# Altium schematic sheet RF.SchDoc
size A4; SheetNumber: 4; SheetTotal: 5
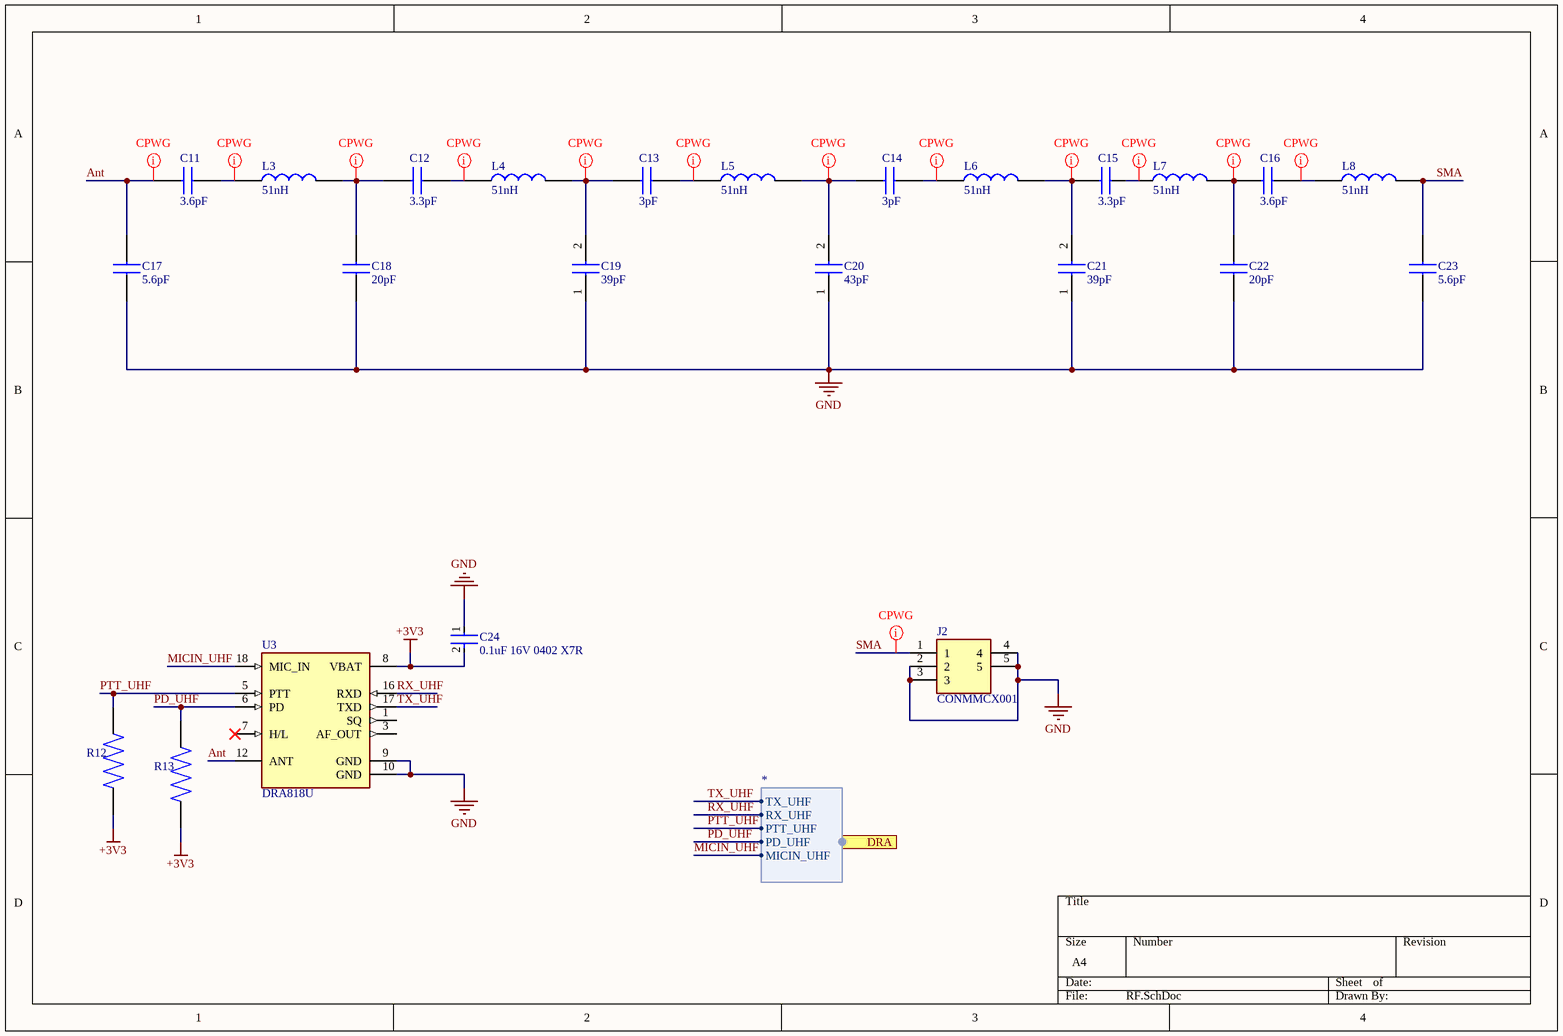
[diagram p0: RF.SchDoc]

## Parts
C11  3.6pF  [CAP0603S]
C12  3.3pF  [CAP0603S]
C13  3pF  [CAP0402S]
C14  3pF  [CAP0402S]
C15  3.3pF  [CAP0603S]
C16  3.6pF  [CAP0603S]
C17  5.6pF  [CAP0603S]
C18  20pF  [CAP0603S]
C19  39pF  [CAP0603S]
C20  43pF  [CAP0603S]
C21  39pF  [CAP0603S]
C22  20pF  [CAP0603S]
C23  5.6pF  [CAP0603S]
C24  0.1uF 16V 0402 X7R  [CAP0402S]
J2  CONMMCX001  [SAMTEC_MMCX-J-P-H-ST-SM1]
L3  51nH  [IND0603S]
L4  51nH  [IND0603S]
L5  51nH  [IND0603S]
L6  51nH  [IND0603S]
L7  51nH  [IND0603S]
L8  51nH  [IND0603S]
R12  CRCW060310K0FKEAC  [RES0603S]  (value not drawn)
R13  CRCW060310K0FKEAC  [RES0603S]  (value not drawn)
U3  DRA818U  [DRA818U]

## Ports
DRA (harness *)

## Harnesses
*: TX_UHF, RX_UHF, PTT_UHF, PD_UHF, MICIN_UHF

## Nets
+3V3: C24.2 R12.1 R13.1 U3.8(VBAT)
GND: C17.1 C18.1 C19.1 C20.1 C21.1 C22.1 C23.1 C24.1 J2.2 J2.3 J2.4 J2.5 U3.9(GND) U3.10(GND)
Ant: C11.1 C17.2 U3.12(ANT)
MICIN_UHF: U3.18(MIC_IN) ; port DRA.MICIN_UHF
PD_UHF: R13.2 U3.6(PD) ; port DRA.PD_UHF
PTT_UHF: R12.2 U3.5(PTT) ; port DRA.PTT_UHF
RX_UHF: U3.16(RXD) ; port DRA.RX_UHF
SMA: C23.2 J2.1 L8.2
TX_UHF: U3.17(TXD) ; port DRA.TX_UHF
NetC11_2: C11.2 L3.1
NetC12_1: C12.1 C18.2 L3.2
NetC12_2: C12.2 L4.1
NetC13_1: C13.1 C19.2 L4.2
NetC13_2: C13.2 L5.1
NetC14_1: C14.1 C20.2 L5.2
NetC14_2: C14.2 L6.1
NetC15_1: C15.1 C21.2 L6.2
NetC15_2: C15.2 L7.1
NetC16_1: C16.1 C22.2 L7.2
NetC16_2: C16.2 L8.1

Not connected (* = marked no-connect by the designer): U3 1(SQ) 3(AF_OUT) 7(H/L)*

## Layout directives
net class CPWG: Ant, NetC11_2, NetC12_1, NetC12_2, NetC13_1, NetC13_2, NetC14_1, NetC14_2, NetC15_1, NetC15_2, NetC16_1, NetC16_2, SMA

## Library data of the parts
C11 C16 = CBR06C369BAGAC: CBR-SMD RF C0G, Ceramic, 3.6 pF, +/-0.1 pF, 250 VDC, 500 VDC, 125C, -55C, C0G, SMD, Fixed, RF, Ultra High Q, Low ESR, Class I, 0.21 % , 10 GOhms, 472, 5.6 mg, 0603, 1.6mm, 0.8mm, 0.8mm, 0.4mm, 4000, 78  Weeks, 120; Manufacturer_Name: KEMET; Geometry.Height: 0.87mm; element14 Part Number: *; element14 Price/Stock: *; Manufacturer_Part_Number: CBR06C369BAGAC; Datasheet Link: http://www.kemet.com/Lists/ProductCatalog/Attachments/490/KEM_C1030_CBR_SMD.pdf
C12 C15 = VJ0603D3R3BXPAJ: Vishay 0603 VJ 3.3pF Ceramic Multilayer Capacitor, 250 V, +125C, COG Dielectric, +/-0.1pF SMD; Geometry.Height: 0.94mm; element14 Part Number: *; element14 Price/Stock: *; Manufacturer_Name: Vishay; Manufacturer_Part_Number: VJ0603D3R3BXPAJ; Datasheet Link: https://g.componentsearchengine.com/Datasheets/2/VJ0603D3R3BXPAJ.pdf
C13 C14 = VJ0603D3R3BXPAJ: QSCF500Q3R0B1GV001T JOHANSON TECHNOLOGY, Capacitor, RF, 3 pF, 50 V, S Series, ± 0.1pF, 150 °C, 0402 [1005 Metric]; Manufacturer_Name: Vishay; Geometry.Height: 0.94mm; element14 Part Number: *; element14 Price/Stock: *; Manufacturer_Part_Number: VJ0603D3R3BXPAJ; Datasheet Link: https://g.componentsearchengine.com/Datasheets/2/VJ0603D3R3BXPAJ.pdf
C17 C23 = 06032U5R6CAT2A: AVX 0603 U 5.6pF Ceramic Multilayer Capacitor, 200 V dc, +125C, C0G Dielectric, +/-0.25pF SMD; Manufacturer_Name: Kyocera AVX; Geometry.Height: 0.9mm; Mouser Part Number: 581-06032U5R6CAT2A; Mouser Price/Stock: https://www.mouser.com/Search/Refine.aspx?Keyword=581-06032U5R6CAT2A; Manufacturer_Part_Number: 06032U5R6CAT2A; Datasheet Link: https://componentsearchengine.com/Datasheets/1/06032U5R6CAT2A.pdf
C18 C22 = CBR02C200F5GAC: CBR-SMD RF C0G, Ceramic, 20 pF, 1%, 50 VDC, 125 VDC, 125C, -55C, C0G, SMD, Fixed, RF, Ultra High Q, Low ESR, Class I, 0.12 % , 10 GOhms, 800, 0.3 mg, 0201, 0.6mm, 0.3mm, 0.3mm, 0.15mm, 15000, 78  Weeks, 120; Manufacturer_Name: KEMET; Geometry.Height: 0.33mm; element14 Part Number: *; element14 Price/Stock: *; Manufacturer_Part_Number: CBR02C200F5GAC; Datasheet Link: http://www.kemet.com/Lists/ProductCatalog/Attachments/490/KEM_C1030_CBR_SMD.pdf
C19 = C0603H390J5GACTU: Capacitor-C0603H390J5GACTU; Manufacturer_Name: KEMET; Datasheet Link: https://content.kemet.com/datasheets/KEM_C1001_C0G_200C_SMD.pdf; Height: 0.87mm; Manufacturer_Part_Number: C0603H390J5GACTU
C20 = CBR06C430J5GACAUTO: Capacitor; Manufacturer_Name: KEMET; Datasheet Link: https://search.kemet.com/download/datasheet/CBR06C430J5GACAUTO; Manufacturer_Part_Number: CBR06C430J5GACAUTO; Mouser Part Number: 80-CBR06C430J5GAUTO; Mouser Price/Stock: https://www.mouser.co.uk/ProductDetail/KEMET/CBR06C430J5GACAUTO?qs=By6Nw2ByBD0kalJAqVwXIA%3D%3D
C21 = C0603H390J5GACTU: Capacitor; Manufacturer_Name: KEMET; Datasheet Link: https://content.kemet.com/datasheets/KEM_C1001_C0G_200C_SMD.pdf; Height: 0.87mm; Manufacturer_Part_Number: C0603H390J5GACTU
C24 = 236180d848d6139a670b325ea6854c9: CAP CER 0.1UF 16V X7R 0402; Manufacturer Part Number: GRM155R71C104KA88D; Manufacturer: Murata; Standoff Height: 0mm; Tolerance: 10%; Voltage Rating: 16Vdc; Material: Ceramic; Capacitance: 0.10μF; Value: 0.10μF; RoHS: TRUE; Temperature Characteristic: X7R; Octopart: https://octopart.com/grm155r71c104ka88d-murata-196880; Digikey Description: CAP CER 0.1UF 16V X7R 0402; Device Class L3: Ceramic Capacitors; Height: 0.55mm; ComponentLink2Description: Datasheet; Temperature Range Low: -55°C; Ipc Land Pattern Name: CAPC10050X219; ComponentLink2URL: https://search.murata.co.jp/Ceramy/image/img/A01X/G101/ENG/GRM155R71H471KA01-01A.pdf; Device Class L1: Passive Components; Lead Free: yes; Category: Cap; Package: GRM15; Temperature: -55°C to +125°C; Device Class L2: Capacitors; Temperature Range High: +125°C; Mouser Description: 0402 0.1 uF 16V ±10 % Tolerance X7R SMT Multilayer Ceramic Capacitor
J2 = CONMMCX001: Body Features: Cable Connector Orientation Straight; Manufacturer_Name: TE Connectivity; Geometry.Height: 4.7mm; Mouser Part Number: N/A; Mouser Price/Stock: https://www.mouser.co.uk/ProductDetail/TE-Connectivity/CONMMCX001?qs=3Rah4i%252BhyCEhpwEdFc1TTw%3D%3D; Manufacturer_Part_Number: CONMMCX001; Datasheet Link: https://www.te.com/commerce/DocumentDelivery/DDEController?Action=srchrtrv&DocNm=CONMMCX001&DocType=Data%20Sheet&DocLang=English&PartCntxt=CONMMCX001&DocFormat=pdf
L3-L8 = LQW18AN51NG00D: Murata LQQ18A Series Wire-wound SMD Inductor with a Ferrite Core, 0.051 uH +/-2% 370mA Idc Q:38; Manufacturer_Name: Murata Electronics; Geometry.Height: 1mm; Mouser Part Number: 81-LQW18AN51NG00D; Mouser Price/Stock: https://www.mouser.co.uk/ProductDetail/Murata-Electronics/LQW18AN51NG00D?qs=W2MaHu96STYTjVpM0YGYyg%3D%3D; Manufacturer_Part_Number: LQW18AN51NG00D; Datasheet Link: https://search.murata.co.jp/Ceramy/image/img/P02/JELF243A-0024.pdf
R12 R13 = CRCW060310K0FKEAC: 10 kOhms Â±1% 0.1W, 1/10W Chip Resistor 0603 (1608 Metric) Thick Film; MF: Vishay Dale; Availability: Unavailable; SnapEDA_Link: https://www.snapeda.com/parts/CRCW060310K0FKEAC/Vishay%20Dale/view-part/510932/?ref=snap; Price: None; Package: 1608 Rohm Semiconductor; MP: CRCW060310K0FKEAC; Value: *
U3 = DRA818V: UHF Band Voice Transceiver Module; MF: DORJI; Price: None; Check_prices: https://www.snapeda.com/parts/DRA818V/DORJI/view-part/2654524/?ref=eda; SnapEDA_Link: https://www.snapeda.com/parts/DRA818V/DORJI/view-part/2654524/?ref=snap; Package: Package; Availability: Unavailable; MP: DRA818V; Value: *